# EasyEDA Pro project 2s锂电保护板HY2120-OB.epro

# Schematic 2s
Board Name: 2s锂电保护板主动均衡; Create Date: 2024-12-01; Page Name: Sheet_1 copy; Project Name: 2s锂电保护板主动均衡_2024-12-01_12-11-13; Schematic Name: 2s锂电保护板主动均衡; Update Date: 2024-12-05; Company: 嘉立创EDA; Page Size: A5; Version: V1.0
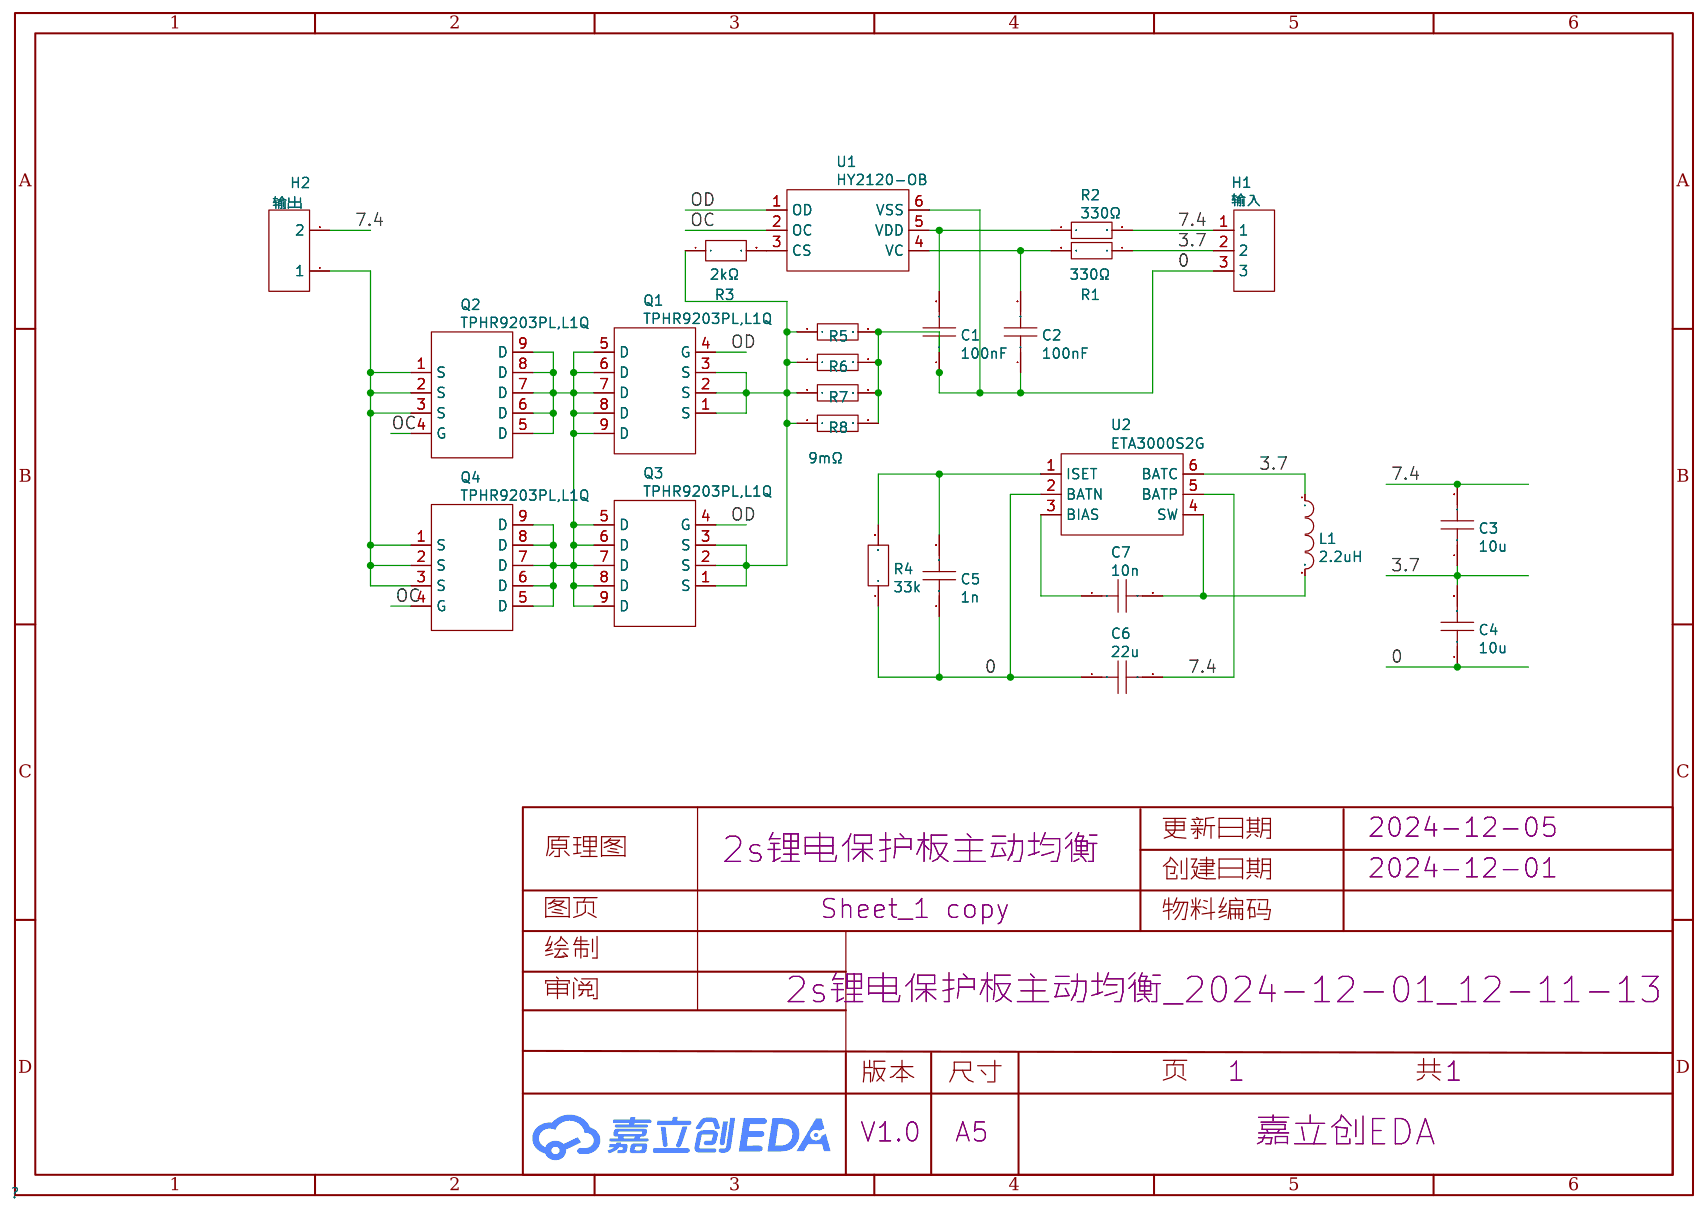
[diagram p0: schematic sheet]

## Parts
C1  100nF  [C0603]
C2  100nF  [C0603]
C3  10u  [C0603]
C4  10u  [C0603]
C5  1n  [C0603]
C6  22u  [C0603]
C7  10n  [C0603]
H1  输入
H2  输出
L1  2.2uH  [IND-SMD_L4.4-W4.0_PHC0420]
Q1  TPHR9203PL,L1Q  [HSOP-8_L6.0-W5.0-P1.27-LS6.0-BL]
Q2  TPHR9203PL,L1Q  [HSOP-8_L6.0-W5.0-P1.27-LS6.0-BL]
Q3  TPHR9203PL,L1Q  [HSOP-8_L6.0-W5.0-P1.27-LS6.0-BL]
Q4  TPHR9203PL,L1Q  [HSOP-8_L6.0-W5.0-P1.27-LS6.0-BL]
R1  330Ω  [R0603]
R2  330Ω  [R0603]
R3  2kΩ  [R0603]
R4  33k  [R0603]
R5  9mΩ  [R1206]
R6  9mΩ  [R1206]
R7  9mΩ  [R1206]
R8  9mΩ  [R1206]
U1  HY2120-OB  [SOT-23-6_L2.9-W1.6-P0.95-LS2.8-BR]
U2  ETA3000S2G  [SOT-23-6_L2.9-W1.6-P0.95-LS2.8-BL]

## Library data of the parts
C1 C2 = CL10B104KC8NNNC: Supplier: LCSC; Manufacturer: SAMSUNG; Supplier Part: C15725; JLCPCB Part Class: Extended Part
C3 C4 = 10u
C5 = 1n
C6 = 22u
C7 = 10n
H1 = Z-211-0311-0021-001: Supplier: LCSC; Manufacturer: ZHENGLING; Supplier Part: C152153; JLCPCB Part Class: Extended Part
H2 = 826629-2: Supplier: LCSC; Manufacturer: TE Connectivity; Supplier Part: C86471; JLCPCB Part Class: Extended Part
L1 = PHC0420-2R2M-T: Supplier: LCSC; Supplier Part: C251688; Manufacturer: EMTEK; JLCPCB Part Class: Extended Part
Q1-Q4 = TPHR9203PL,L1Q: 类型:1个N沟道;漏源电压(Vdss):30V;连续漏极电流(Id):150A;功率(Pd):132W;阈值电压(Vgs(th)@Id):2.1V@500uA;; LCSC Part Name: 1个N沟道 耐压:30V 电流:150A; Supplier Part: C7073243; Manufacturer: TOSHIBA(东芝); Supplier Footprint: SOP-8; JLCPCB Part Class: Extended Part; Supplier: LCSC; Type: 1个N沟道; Drain Source Voltage (Vdss): 30V; Continuous Drain Current (Id): 150A; Power Dissipation (Pd): 132W; Gate Threshold Voltage (Vgs(th)@Id): 2.1V@500uA; Total Gate Charge (Qg@Vgs): 80nC@10V; Input Capacitance (Ciss@Vds): 7.54nF@15V
R1 R2 = RN731JTTD3300B25: Supplier: LCSC; Supplier Part: C186383; Manufacturer: KOA Speer Elec; Resistance: 330; JLCPCB Part Class: Extended Part
R3 = 0603WAD2001T5E: Supplier: LCSC; Supplier Part: C407619; Manufacturer: Uniroyal Elec; Resistance: 2K; JLCPCB Part Class: Extended Part
R4 = 33k
R5-R8 = STE1206M1W0R009F: 阻值:9mΩ;精度:±1%;功率:1W;温度系数:±100ppm/℃;; LCSC Part Name: 9mΩ ±1% 1W; Supplier Part: C201275; Manufacturer: WALTER(华德); Supplier Footprint: 1206; JLCPCB Part Class: Extended Part; Datasheet: https://atta.szlcsc.com/upload/public/pdf/source/20190620/C388471_536FA2A120C516F48DEDAE856055D3B0.pdf; Supplier: LCSC; Tolerance: ±1%; Power(Watts): 1W; Temperature Coefficient: ±100ppm/℃
U1 = HY2120-LB: Supplier: LCSC; Manufacturer: HYCON; Supplier Part: C168778; JLCPCB Part Class: Extended Part
U2 = ETA3000S2G: JLCPCB Part Class: Extend; Manufacturer: ETA(钰泰)

## Nets
0: C1.1 C2.1 C4.1 C5.1 C6.1 H1.3 R4.1 R5.2 R6.2 R7.2 R8.2 U1.6(VSS) U2.2(BATN)
3.7: C3.1 C4.2 H1.2 L1.1 R1.1 U2.6(BATC)
7.4: C3.2 C6.2 H1.1 H2.2 R2.2 U2.5(BATP)
OC: Q2.4(G) Q4.4(G) U1.2(OC)
OD: Q1.4(G) Q3.4(G) U1.1(OD)
$1N1: C5.2 R4.2 U2.1(ISET)
$1N6: C7.2 L1.2 U2.4(SW)
$1N7: C7.1 U2.3(BIAS)
$1N14: Q1.1(S) Q1.2(S) Q1.3(S) Q3.1(S) Q3.2(S) Q3.3(S) R3.1 R5.1 R6.1 R7.1 R8.1
$1N24: C2.2 R1.2 U1.4(VC)
$1N25: C1.2 R2.1 U1.5(VDD)
$1N242: R3.2 U1.3(CS)
Net-(H2-1): H2.1 Q2.1(S) Q2.2(S) Q2.3(S) Q4.1(S) Q4.2(S) Q4.3(S)
Net-(Q1-5): Q1.5(D) Q1.6(D) Q1.7(D) Q1.8(D) Q1.9(D) Q2.5(D) Q2.6(D) Q2.7(D) Q2.8(D) Q2.9(D) Q3.5(D) Q3.6(D) Q3.7(D) Q3.8(D) Q3.9(D) Q4.5(D) Q4.6(D) Q4.7(D) Q4.8(D) Q4.9(D)

# Board PCB
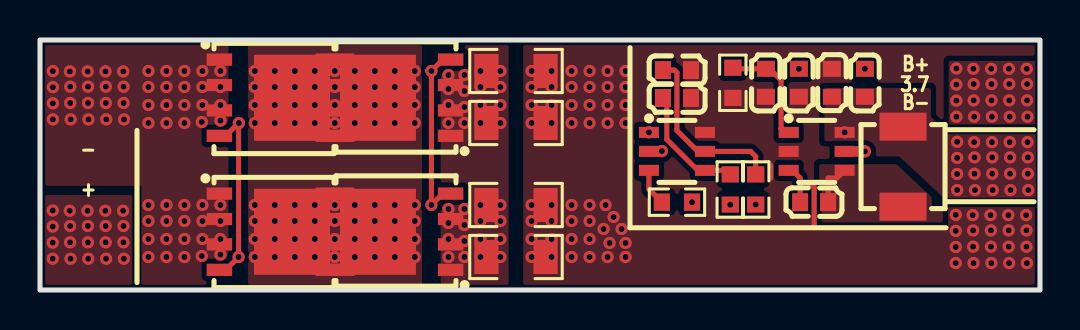
[diagram p1: board, top side]
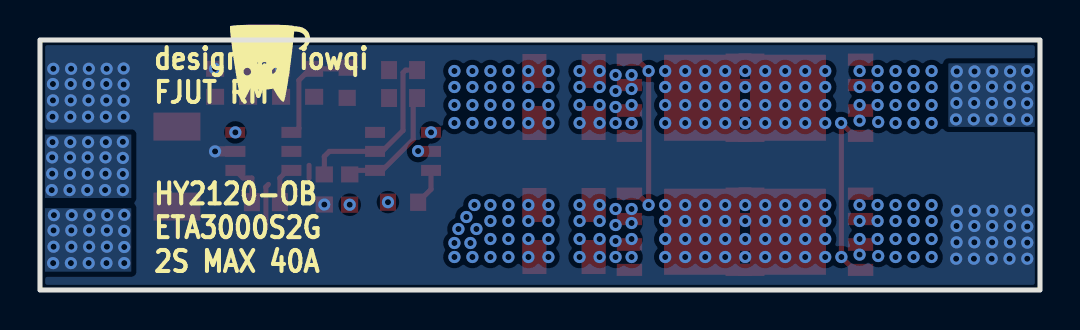
[diagram p2: board, bottom side, seen from below]

Outline 50 x 12.5 mm; copper layers: Top Layer, Inner1, Inner2, Bottom Layer. Coordinates in mm from the lower left corner of the outline.
Outline path: rectangle 0,12.5 50,0
Stack: Top Layer 0.035mm 外层铜厚1oz / Dielectric1 0.2104mm 7628 RC49% 8.6mil / Inner1 0.0152mm 内层铜厚 / Dielectric2 1.065mm 1.1mm H/HOZ Copper / Inner2 0.0152mm 内层铜厚 / Dielectric3 0.2104mm 7628 RC49% 8.6mil / Bottom Layer 0.035mm 外层铜厚1oz

## Design rules (mm)
net OC: DP1
net OD: DP1
spacing Default (default): track to track 0.152, other pairs 0 to 0.152
track width Default (default): min 0.254, default 0.254, max 25.4
differential pair differentialPair (default): width min 0.127, default 0.254, max 2.54; gap min 0.152, default 0.152
via Default (default): diameter min 0.61, default 0.61, max 100.025; hole min 0.305, default 0.305, max 59.995
net 0 uses gge2352
net 3.7 uses gge2352
net 7.4 uses gge2352
net $1N6 uses gge2352
net $1N14 uses gge2352
net $1N26 uses gge2352
net $1N13 uses gge2352
pour e10 uses gge2352
pour e67 uses gge2352
pour e75 uses gge2352

## Placement (name value [footprint] x y rotation side)
C1  100nF  [C0603]  31.85 11 180 top
C2  100nF  [C0603]  31.85 9.6 180 top
C3  10u  [C0603]  41.25 10.36 90 top
C4  10u  [C0603]  39.59 10.36 270 top
C5  1n  [C0603]  36.29 10.36 90 top
C6  22u  [C0603]  37.94 10.36 90 top
C7  10n  [C0603]  38.71 4.39 0 top
L1  2.2uH  [IND-SMD_L4.4-W4.0_PHC0420]  43.15 6.17 270 top
Q1  TPHR9203PL,L1Q  [HSOP-8_L6.0-W5.0-P1.27-LS6.0-BL]  17.8 2.91 90 top
Q2  TPHR9203PL,L1Q  [HSOP-8_L6.0-W5.0-P1.27-LS6.0-BL]  11.7 9.61 270 top
Q3  TPHR9203PL,L1Q  [HSOP-8_L6.0-W5.0-P1.27-LS6.0-BL]  17.8 9.61 90 top
Q4  TPHR9203PL,L1Q  [HSOP-8_L6.0-W5.0-P1.27-LS6.0-BL]  11.7 2.91 270 top
R1  330Ω  [R0603]  34.51 5.03 90 top
R2  330Ω  [R0603]  35.78 5.03 270 top
R3  2kΩ  [R0603]  31.85 4.39 180 top
R4  33k  [R0603]  34.64 10.36 90 top
R5  9mΩ  [R1206]  23.8 1.65 0 top
R6  9mΩ  [R1206]  23.8 10.95 0 top
R7  9mΩ  [R1206]  23.8 8.35 0 top
R8  9mΩ  [R1206]  23.8 4.25 0 top
U1  HY2120-OB  [SOT-23-6_L2.9-W1.6-P0.95-LS2.8-BR]  31.85 6.93 180 top
U2  ETA3000S2G  [SOT-23-6_L2.9-W1.6-P0.95-LS2.8-BL]  38.83 6.93 270 top

## Footprints (pads in the part's own frame, mm; a bottom-side part is the same pattern mirrored in y, then rotated)
C0603
  rect 0.8x0.9 smd: 1(-0.7,0) 2(0.7,0)
HSOP-8_L6.0-W5.0-P1.27-LS6.0-BL
  rect 0.61x1.27 smd: 1(-1.905,-2.731) 2(-0.635,-2.731) 3(0.635,-2.731) 4(1.905,-2.731)
  rect 0.61x1.3 smd: 5(1.905,2.731) 6(0.635,2.731) 7(-0.635,2.731) 8(-1.905,2.731)
  rect 4.3x3.8 smd: 8(0,0.902)
IND-SMD_L4.4-W4.0_PHC0420
  rect 1.4x2.35 smd: 1(-2,0) 2(2,0)
R0603
  rect 0.806x0.864 smd: 1(-0.753,0) 2(0.753,0)
R1206
  rect 1.208x1.701 smd: 1(-1.479,0) 2(1.479,0)
SOT-23-6_L2.9-W1.6-P0.95-LS2.8-BL
  rect 0.55x1 smd: 1(-0.95,-1.4) 2(0,-1.4) 3(0.95,-1.4) 4(0.95,1.4) 5(0,1.4) 6(-0.95,1.4)
SOT-23-6_L2.9-W1.6-P0.95-LS2.8-BR
  rect 1x0.55 smd: 1(1.4,-0.95) 2(1.4,0) 3(1.4,0.95) 4(-1.4,0.95) 5(-1.4,0) 6(-1.4,-0.95)

## Nets
As in the schematic, except:
$1N13: Q2.1 Q2.2 Q2.3 Q4.1 Q4.2 Q4.3
$1N26: Q1.5 Q1.6 Q1.7 Q1.8 Q2.5 Q2.6 Q2.7 Q2.8 Q3.5 Q3.6 Q3.7 Q3.8 Q4.5 Q4.6 Q4.7 Q4.8

## Via types
v1: diameter 0.61, hole 0.305, Top Layer to Bottom Layer, 305 vias

## Routing (per net, layer and track width the routed paths; a pad name or vN(x,y) marks a point on that pad's centre or on a via; arc(x,y) is an arc through that point)
0: length 2.8
  Top Layer w0.254: 38.58,5.28 38.71,5.15 38.71,3.12 ; 36.55,6.23 36.55,5.6
  vias: v1(24.58,10.95) v1(24.58,10.15) v1(24.58,9.25) v1(24.58,8.35) v1(24.58,4.25) v1(24.58,3.45) v1(24.58,2.55) v1(24.58,1.65) v1(25.58,10.95) v1(25.58,10.15) v1(25.58,9.25) v1(25.58,8.35) v1(25.58,4.25) v1(25.58,3.45) v1(25.58,2.55) v1(25.58,1.65) v1(26.58,10.95) v1(26.58,10.15) v1(26.58,9.25) v1(26.58,8.35) v1(26.58,4.25) v1(26.58,3.45) v1(26.58,2.55) v1(26.58,1.65) v1(27.48,10.95) v1(27.48,10.15) v1(27.48,9.25) v1(27.48,8.35) v1(27.48,4.25) v1(27.48,3.45) v1(27.48,2.55) v1(27.48,1.65) v1(28.18,3.05) v1(28.28,4.25) v1(28.38,10.95) v1(28.38,10.15) v1(28.38,9.25) v1(28.38,8.35) v1(28.38,1.65) v1(28.48,2.35) v1(28.68,3.65) v1(29.08,3.05) v1(29.28,10.95) v1(29.28,10.15) v1(29.28,9.25) v1(29.28,8.35) v1(29.28,2.35) v1(29.28,1.65) v1(45.79,3.76) v1(45.79,2.95) v1(45.79,2.15) v1(45.79,1.35) v1(46.64,3.74) v1(46.66,2.98) v1(46.66,2.16) v1(46.68,1.35) v1(47.53,3.74) v1(47.54,2.98) v1(47.54,2.16) v1(47.57,1.35) v1(48.42,3.74) v1(48.43,2.98) v1(48.43,2.16) v1(48.46,1.35) v1(49.31,3.74) v1(49.32,2.98) v1(49.32,2.16) v1(49.34,1.35)
3.7: length 7.2
  Inner2 w0.254: R1.1 38.12,7.88 v1(40.23,7.88)
  vias: v1(34.51,4.26) v1(45.86,7.41) v1(45.86,6.6) v1(45.86,5.8) v1(45.86,5) v1(46.71,7.39) v1(46.72,6.63) v1(46.72,5.81) v1(46.75,5) v1(47.6,7.39) v1(47.61,6.63) v1(47.61,5.81) v1(47.63,5) v1(48.49,7.39) v1(48.5,6.63) v1(48.5,5.81) v1(48.52,5) v1(49.37,7.39) v1(49.39,6.63) v1(49.39,5.81) v1(49.41,5)
7.4: length 1
  Top Layer w0.52: v1(41.25,6.93) U2.5
  vias: v1(0.64,3.98) v1(0.64,3.17) v1(0.64,2.37) v1(0.64,1.56) v1(1.49,3.96) v1(1.5,3.2) v1(1.5,2.38) v1(1.53,1.56) v1(2.38,3.96) v1(2.39,3.2) v1(2.39,2.38) v1(2.42,1.56) v1(3.27,3.96) v1(3.28,3.2) v1(3.28,2.38) v1(3.3,1.56) v1(4.15,3.96) v1(4.17,3.2) v1(4.17,2.38) v1(4.19,1.56) v1(35.78,4.27) v1(37.94,11.06) v1(41.25,11.06) v1(45.82,11.08) v1(45.82,10.27) v1(45.82,9.47) v1(45.82,8.66) v1(46.67,11.06) v1(46.69,10.3) v1(46.69,9.48) v1(46.71,8.66) v1(47.56,11.06) v1(47.57,10.3) v1(47.57,9.48) v1(47.6,8.66) v1(48.45,11.06) v1(48.46,10.3) v1(48.46,9.48) v1(48.49,8.66) v1(49.34,11.06) v1(49.35,10.3) v1(49.35,9.48) v1(49.37,8.66)
OC: length 34.8
  Top Layer w0.254: 8.93,7.71 9.29,7.71 9.93,8.35 v1(9.93,1.65) 9.29,1.01 8.93,1.01 ; U1.2 31.08,6.93 v1(31.1,6.95)
  Inner1 w0.254: 9.93,1.75 9.93,4.54 11.74,6.35 30.51,6.35 v1(31.1,6.95)
  vias: v1(9.94,8.35)
OD: length 23.7
  Top Layer w0.254: 20.57,11.52 20.14,11.52 v1(19.57,10.95) v1(19.57,4.25) 20.14,4.82 20.57,4.82
  Inner1 w0.254: v1(19.57,10.95) 19.57,8.14 20.75,6.96 29.53,6.96 v1(30.45,7.88)
$1N1: length 5.5
  Top Layer w0.254: 37.43,7.88 37.25,7.88 37.06,8.07 37.06,10.49 36.48,11.06 C5.2 34.7,11.06 R4.2
$1N6: length 2.2
  Top Layer w0.254: C7.2 39.41,5.6 39.85,5.6 U2.4
$1N7: length 1.9
  Top Layer w0.254: C7.1 38.01,5.6 37.62,5.98 U2.3
$1N13:
  vias: v1(0.64,10.94) v1(0.64,10.14) v1(0.64,9.34) v1(0.64,8.53) v1(1.5,10.93) v1(1.51,10.17) v1(1.51,9.35) v1(1.53,8.53) v1(2.38,10.93) v1(2.4,10.17) v1(2.4,9.35) v1(2.42,8.53) v1(3.27,10.93) v1(3.29,10.17) v1(3.29,9.35) v1(3.31,8.53) v1(4.16,10.93) v1(4.18,10.17) v1(4.18,9.35) v1(4.2,8.53) v1(5.42,10.95) v1(5.42,10.15) v1(5.42,9.25) v1(5.42,8.35) v1(5.42,4.25) v1(5.42,3.45) v1(5.42,2.55) v1(5.42,1.65) v1(6.32,10.95) v1(6.32,10.15) v1(6.32,9.25) v1(6.32,8.35) v1(6.32,4.25) v1(6.32,3.45) v1(6.32,2.55) v1(6.32,1.65) v1(7.22,10.95) v1(7.22,10.15) v1(7.22,9.25) v1(7.22,8.35) v1(7.22,4.25) v1(7.22,3.45) v1(7.22,2.55) v1(7.22,1.65) v1(8.12,10.95) v1(8.12,10.15) v1(8.12,9.25) v1(8.09,8.4) v1(8.12,4.25) v1(8.12,3.45) v1(8.12,2.55) v1(8.09,1.7) v1(9.02,10.95) v1(9.02,10.15) v1(9.02,9.25) v1(9.02,8.47) v1(9.02,4.25) v1(9.02,3.45) v1(9.02,2.55) v1(9.02,1.77)
$1N14: length 11.5
  Inner1 w0.254: 22.25,4.35 23.61,5.71 31.28,5.71 R3.1
  vias: v1(20.42,10.75) v1(20.42,10.05) v1(20.42,9.25) v1(20.42,8.35) v1(20.42,4.05) v1(20.42,3.35) v1(20.42,2.55) v1(20.42,1.65) v1(21.22,10.75) v1(21.22,9.95) v1(21.22,9.15) v1(21.22,8.35) v1(21.22,4.05) v1(21.22,3.25) v1(21.22,2.45) v1(21.22,1.65) v1(22.02,10.95) v1(22.02,10.15) v1(22.02,9.25) v1(22.02,8.35) v1(22.02,4.25) v1(22.02,3.45) v1(22.02,2.55) v1(22.02,1.65) v1(23.02,10.95) v1(23.02,10.15) v1(23.02,9.25) v1(23.02,8.35) v1(23.02,4.25) v1(23.02,3.45) v1(23.02,2.55) v1(23.02,1.65) v1(32.6,4.39)
$1N24: length 6
  Top Layer w0.254: C2.2 31.34,9.41 31.34,7.53 32.89,5.98 U1.4 34.31,5.98 R1.2
$1N25: length 9
  Top Layer w0.254: C1.2 31.72,11 31.85,10.87 31.85,7.97 32.89,6.93 U1.5 35.53,6.93 35.78,6.68 R2.1
$1N26:
  vias: v1(10.74,10.95) v1(10.74,10.15) v1(10.74,9.25) v1(10.74,8.35) v1(10.74,4.25) v1(10.74,3.45) v1(10.74,2.55) v1(10.74,1.65) v1(11.74,10.95) v1(11.74,10.15) v1(11.74,9.25) v1(11.74,8.35) v1(11.74,4.25) v1(11.74,3.45) v1(11.74,2.55) v1(11.74,1.65) v1(12.74,10.95) v1(12.74,10.15) v1(12.74,9.25) v1(12.74,8.35) v1(12.74,4.25) v1(12.74,3.45) v1(12.74,2.55) v1(12.74,1.65) v1(13.74,10.95) v1(13.74,10.15) v1(13.74,9.25) v1(13.74,8.35) v1(13.74,4.25) v1(13.74,3.45) v1(13.74,2.55) v1(13.74,1.65) v1(14.74,10.95) v1(14.74,10.15) v1(14.74,9.25) v1(14.74,8.35) v1(14.74,4.25) v1(14.74,3.45) v1(14.74,2.55) v1(14.74,1.65) v1(15.74,10.95) v1(15.74,10.15) v1(15.74,9.25) v1(15.74,8.35) v1(15.74,4.25) v1(15.74,3.45) v1(15.74,2.55) v1(15.74,1.65) v1(16.74,10.95) v1(16.74,10.15) v1(16.74,9.25) v1(16.74,8.35) v1(16.74,4.25) v1(16.74,3.45) v1(16.74,2.55) v1(16.74,1.65) v1(17.74,10.95) v1(17.74,10.15) v1(17.74,9.25) v1(17.74,8.35) v1(17.74,4.25) v1(17.74,3.45) v1(17.74,2.55) v1(17.74,1.65) v1(18.74,10.95) v1(18.74,10.15) v1(18.74,9.25) v1(18.74,8.35) v1(18.74,4.25) v1(18.74,3.45) v1(18.74,2.55) v1(18.74,1.65)
$1N242: length 1.9
  Top Layer w0.254: R3.2 30.45,5.04 U1.3

## Copper pours and planes (outline as drawn; the poured copper is in the pictures)
0 on Top Layer: 45.41,4.14 49.72,4.14 49.72,0.96 45.41,0.96
0 on Top Layer: 24.16,12.5 24.16,0.01 50,0 50,12.5
0 on Bottom Layer: 45.44,4.09 49.75,4.09 49.75,0.92 45.44,0.92
0 on Inner1: 24.16,12.5 24.16,0.01 50,0 50,12.5
3.7 on Top Layer: 45.48,7.79 49.79,7.79 49.79,4.61 45.48,4.61
3.7 on Top Layer: 49.75,4.6 45.19,4.6 42.96,6.68 39.98,6.68 39.98,8.96 44.25,8.96 45.44,7.77 49.75,7.77
3.7 on Top Layer: 39.21,10.11 39.21,7.44 44.55,7.44 44.55,10.11
3.7 on Bottom Layer: 45.44,7.77 49.75,7.77 49.75,4.6 45.44,4.6
7.4 on Top Layer: 45.44,11.46 49.75,11.46 49.75,8.28 45.44,8.28
7.4 on Top Layer: 0.03,4.75 0.03,0.05 4.61,0.05 4.61,4.75
7.4 on Top Layer: 0.26,4.35 4.58,4.35 4.58,1.18 0.26,1.18
7.4 on Bottom Layer: 0.1,12.5 0.1,0 50.1,0 50.11,12.5
7.4 on Inner2: 0,12.5 50,12.5 50,0 0,0
$1N6 on Top Layer: 38.96,6.3 38.96,3.38 45.94,3.38 42.82,6.3
$1N13 on Top Layer: 0.26,11.31 4.58,11.31 4.58,8.13 0.26,8.13
$1N13 on Top Layer: 0,12.5 9.42,12.5 9.42,0 5.08,0 5.08,5.21 0,5.21
$1N13 on Bottom Layer: 0.26,11.33 4.58,11.33 4.58,8.16 0.26,8.16
$1N13 on Inner1: 0,12.5 9.42,12.5 9.42,0 5.08,0 5.08,5.21 0,5.21
$1N14 on Top Layer: 20.03,12.5 23.43,12.5 23.43,0 20.03,0
$1N14 on Inner1: 20.03,12.5 23.43,12.5 23.43,0 20.03,0
$1N26 on Top Layer: 10.4,12.51 19.1,12.51 19.1,0.01 10.4,0.01
$1N26 on Top Layer: 10.4,11.04 19.1,11.04 19.1,1.51 10.4,1.51
$1N26 on Inner1: 10.4,12.51 19.1,12.51 19.1,0.01 10.4,0.01

## Text on the board
Bottom Silkscreen Layer: design by iowqi / FJUT RM / HY2120-OB / ETA3000S2G / 2S MAX 40A
Top Silkscreen Layer: - | + | 3.7 | B+ | B-
